# Altium schematic sheet FPGA3.SchDoc: FPGA-3
size A; Revision: 05
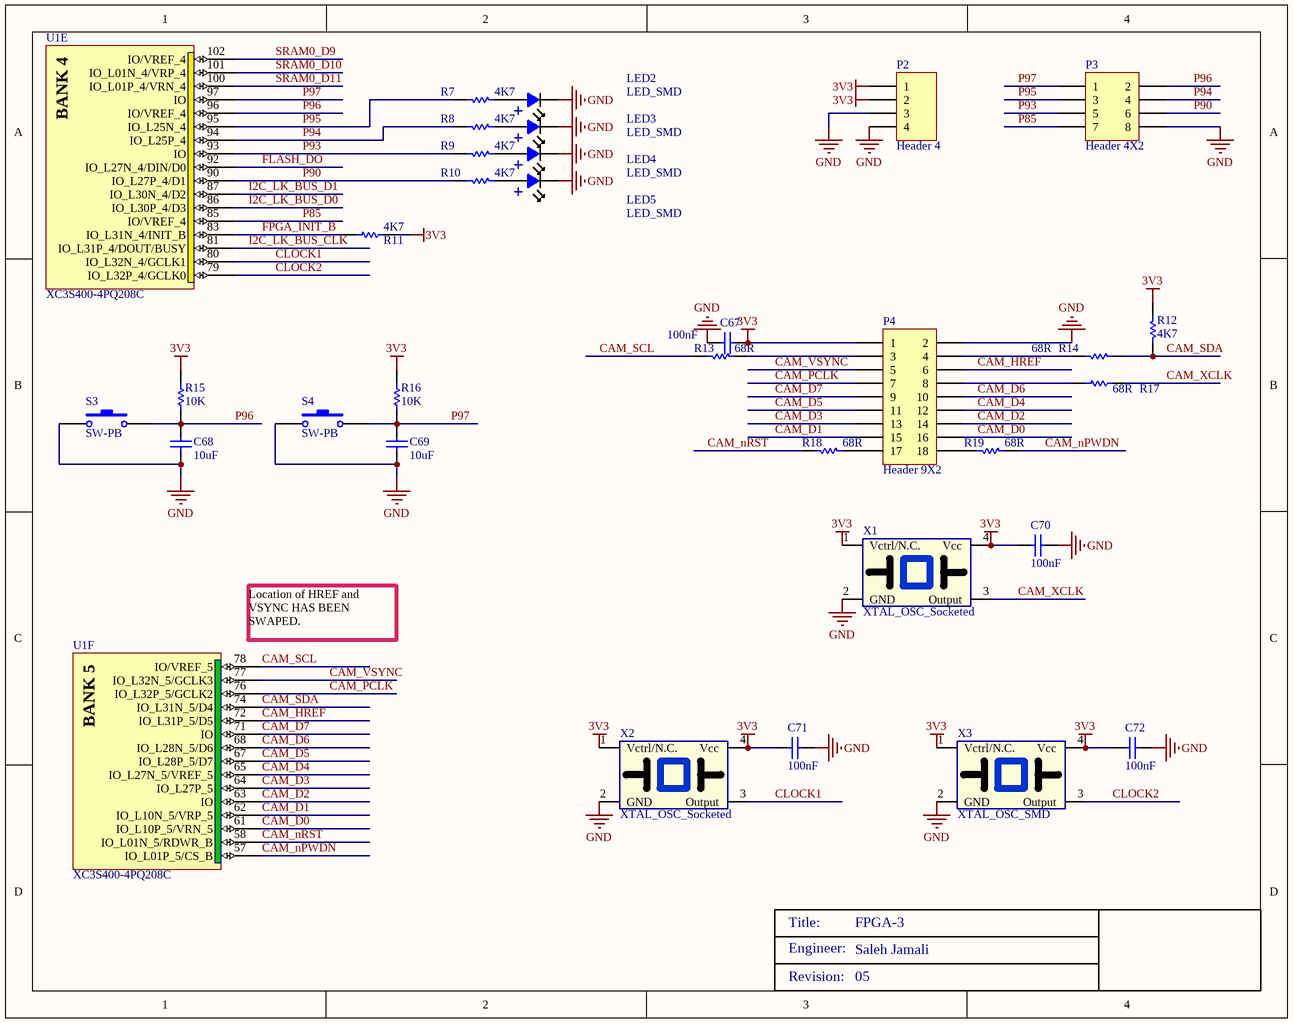
[diagram p0: FPGA3.SchDoc]

## Parts
C67  value 100nF  [0805]  (hidden comment: C0805)
C68  value 10uF  [0805]  (hidden comment: C0805)
C69  value 10uF  [0805]  (hidden comment: C0805)
C70  value 100nF  [0805]  (hidden comment: C0805)
C71  value 100nF  [0805]  (hidden comment: C0805)
C72  value 100nF  [0805]  (hidden comment: C0805)
LED2  LED_SMD  [LED_805]
LED3  LED_SMD  [LED_805]
LED4  LED_SMD  [LED_805]
LED5  LED_SMD  [LED_805]
P2  Header 4  [HDR1X4]
P3  Header 4X2  [HDR2X4]
P4  Header 9X2  [HDR2X9]
R7  4K7  [ERA-0805]
R8  4K7  [ERA-0805]
R9  4K7  [ERA-0805]
R10  4K7  [ERA-0805]
R11  4K7  [ERA-0805]
R12  4K7  [ERA-0805]
R13  68R  [ERA-0805]
R14  68R  [ERA-0805]
R15  10K  [ERA-0805]
R16  10K  [ERA-0805]
R17  68R  [ERA-0805]
R18  68R  [ERA-0805]
R19  68R  [ERA-0805]
S3  SW-PB  [SPST-2]
S4  SW-PB  [SPST-2]
U1  XC3S400-4PQ208C  [PQ208_N]  (parts E,F of 11)
X1  XTAL_OSC_Socketed  [CRYSTAL_OSC]
X2  XTAL_OSC_Socketed  [CRYSTAL_OSC]
X3  XTAL_OSC_SMD  [5x7mm SMD]

## Nets
3V3: C67.2 C70.1 C71.1 C72.1 P2.1 P2.2 P4.1 R11.1 R12.1 R15.1 R16.1 X1.1(Vctrl/N.C.) X1.4(Vcc) X2.1(Vctrl/N.C.) X2.4(Vcc) X3.1(Vctrl/N.C.) X3.4(Vcc)
GND: C67.1 C68.1 C69.1 C70.2 C71.2 C72.2 LED2.2 LED3.2 LED4.2 LED5.2 P2.3 P2.4 P3.8 P4.2 S3.1 S4.1 X1.2(GND) X2.2(GND) X3.2(GND)
CAM_D0: P4.16 U1.61(IO_L10P_5/VRN_5)
CAM_D1: P4.15 U1.62(IO_L10N_5/VRP_5)
CAM_D2: P4.14 U1.63(IO)
CAM_D3: P4.13 U1.64(IO_L27P_5)
CAM_D4: P4.12 U1.65(IO_L27N_5/VREF_5)
CAM_D5: P4.11 U1.67(IO_L28P_5/D7)
CAM_D6: P4.10 U1.68(IO_L28N_5/D6)
CAM_D7: P4.9 U1.71(IO)
CAM_HREF: P4.6 U1.72(IO_L31P_5/D5)
CAM_nPWDN: R19.2 U1.57(IO_L01P_5/CS_B)
CAM_nRST: R18.1 U1.58(IO_L01N_5/RDWR_B)
CAM_PCLK: P4.7 U1.76(IO_L32P_5/GCLK2)
CAM_SCL: R13.1 U1.78(IO/VREF_5)
CAM_SDA: R12.2 R14.1 U1.74(IO_L31N_5/D4)
CAM_VSYNC: P4.5 U1.77(IO_L32N_5/GCLK3)
CAM_XCLK: R17.1 X1.3(Output)
CLOCK1: U1.80(IO_L32N_4/GCLK1) X2.3(Output)
CLOCK2: U1.79(IO_L32P_4/GCLK0) X3.3(Output)
FLASH_DO: U1.92(IO_L27N_4/DIN/D0)
FPGA_INIT_B: R11.2 U1.83(IO_L31N_4/INIT_B)
I2C_LK_BUS_CLK: U1.81(IO_L31P_4/DOUT/BUSY)
I2C_LK_BUS_D0: U1.86(IO_L30P_4/D3)
I2C_LK_BUS_D1: U1.87(IO_L30N_4/D2)
P85: P3.7 U1.85(IO/VREF_4)
P90: P3.6 R10.1 U1.90(IO_L27P_4/D1)
P93: P3.5 R9.1 U1.93(IO)
P94: P3.4 R8.1 U1.94(IO_L25P_4)
P95: P3.3 R7.1 U1.95(IO_L25N_4)
P96: C68.2 P3.2 R15.2 S3.2 U1.96(IO/VREF_4)
P97: C69.2 P3.1 R16.2 S4.2 U1.97(IO)
SRAM0_D9: U1.102(IO/VREF_4)
SRAM0_D10: U1.101(IO_L01N_4/VRP_4)
SRAM0_D11: U1.100(IO_L01P_4/VRN_4)
NetLED2_1: LED2.1 R7.2
NetLED3_1: LED3.1 R8.2
NetLED4_1: LED4.1 R9.2
NetLED5_1: LED5.1 R10.2
NetP4_3: P4.3 R13.2
NetP4_4: P4.4 R14.2
NetP4_8: P4.8 R17.2
NetP4_17: P4.17 R18.2
NetP4_18: P4.18 R19.1

## Notes on the sheet
- (near U1) Location of HREF and VSYNC HAS BEEN SWAPED.
- Engineer:
- Title:
- Saleh Jamali
- Revision:
- (in symbol XC3S400-4PQ208C, part E) BANK 4
- (in symbol XC3S400-4PQ208C, part F) BANK 5

## Library data of the parts
C67-C72 = C0805: Ceramic Chip Capacitor - Standard; Note: Footprint corresponds to dimensions for bulk cassette packaging. This case size has tightened tolerances.; Published: 17-Jul-2002; LatestRevisionDate: 19-Mar-2004; LatestRevisionNote: Silkscreen size reduced.; DatasheetDocument: Mar-2001; PackageDocument: Mar-2001; PackageReference: 0805; Publisher: Altium Limited; Code_JEITA: 0805; Code_IPC: 2012[0805]; ComponentLink1Description: Manufacturer Link; ComponentLink1URL: http://www.kemet.com/; ComponentLink2Description: Datasheet; ComponentLink2URL: http://www.kemet.com/kemet/web/homepage/kechome.nsf/vapubfilesname/F3102TA.pdf/$file/F3102TA.pdf
P2 = Header 4: Header, 4-Pin; LatestRevisionDate: 17-Jul-2002; LatestRevisionNote: Re-released for DXP Platform.; Publisher: Altium Limited
P3 = Header 4X2: Header, 4-Pin, Dual row; LatestRevisionDate: 17-Jul-2002; LatestRevisionNote: Re-released for DXP Platform.; Publisher: Altium Limited
P4 = Header 9X2: Header, 9-Pin, Dual row; LatestRevisionDate: 17-Jul-2002; LatestRevisionNote: Re-released for DXP Platform.; Publisher: Altium Limited
R7-R19 = ERA6Y: Rectangular Thick Film Chip Resistor, 10 Ohm to 1M Ohm Range, 0.1% and 0.5% Tolerance, 0805 Size, 0.1 W; Note: If flow soldering, adjust pad width of PCB Footprint to 0.7 - 0.8 times the width of the resistor.; Published: 17-Dec-2003; LatestRevisionDate: 19-Mar-2004; LatestRevisionNote: Silkscreen size reduced.; PackageDocument: Mar-2003; PackageReference: ERA-0805; Publisher: Altium Limited; Code_IPC: 2012 [0805]; ComponentLink1Description: Manufacturer Link; ComponentLink1URL: http://www.panasonic.com/industrial/components/resistive_products.htm; ComponentLink2Description: Datasheet; ComponentLink2URL: http://www.panasonic.com/industrial/components/pdf/AOA0000CE8.pdf
S3 S4 = SW-PB: Switch; Published: 24-Mar-1999; LatestRevisionDate: 17-Jul-2002; LatestRevisionNote: Re-released for DXP Platform.; PackageReference: SPST-2; Publisher: Altium Limited; PackageDescription: Switch; 2 Leads
U1 = XC3S400-4PQ208C: Spartan-3 1.2V FPGA, 141 User I/Os, 208-Pin PQFP, Standard Performance, Commercial Grade; OrderingInformation: Additional code may have to be appended for different mask revision devices.; DatasheetVersion: ver2.5, Dec-2009; PackageVersion: ver1.2, Jun-2004; PackageReference: PQ208; PackageDescription: 208-Pin Plastic Quad Flat Pack (PQ208); Code_JEDEC: MS-029-FA-1; ComponentLink1Description: Manufacturer URL; ComponentLink1URL: http://www.xilinx.com/; ComponentLink2Description: Spartan-3 Datasheet; ComponentLink2URL: http://www.xilinx.com/support/documentation/data_sheets/ds099.pdf; ComponentLink3Description: PQ208 Package Drawing; ComponentLink3URL: http://www.xilinx.com/support/documentation/package_specs/pq208.pdf; ComponentLink4Description: Spartan-3 Documents; ComponentLink4URL: http://www.xilinx.com/support/documentation/spartan-3.htm
X1-X3 = Crystal Oscillator